# Altium schematic sheet Green Loop.SchDoc
size A3; SheetNumber: 5; SheetTotal: 11
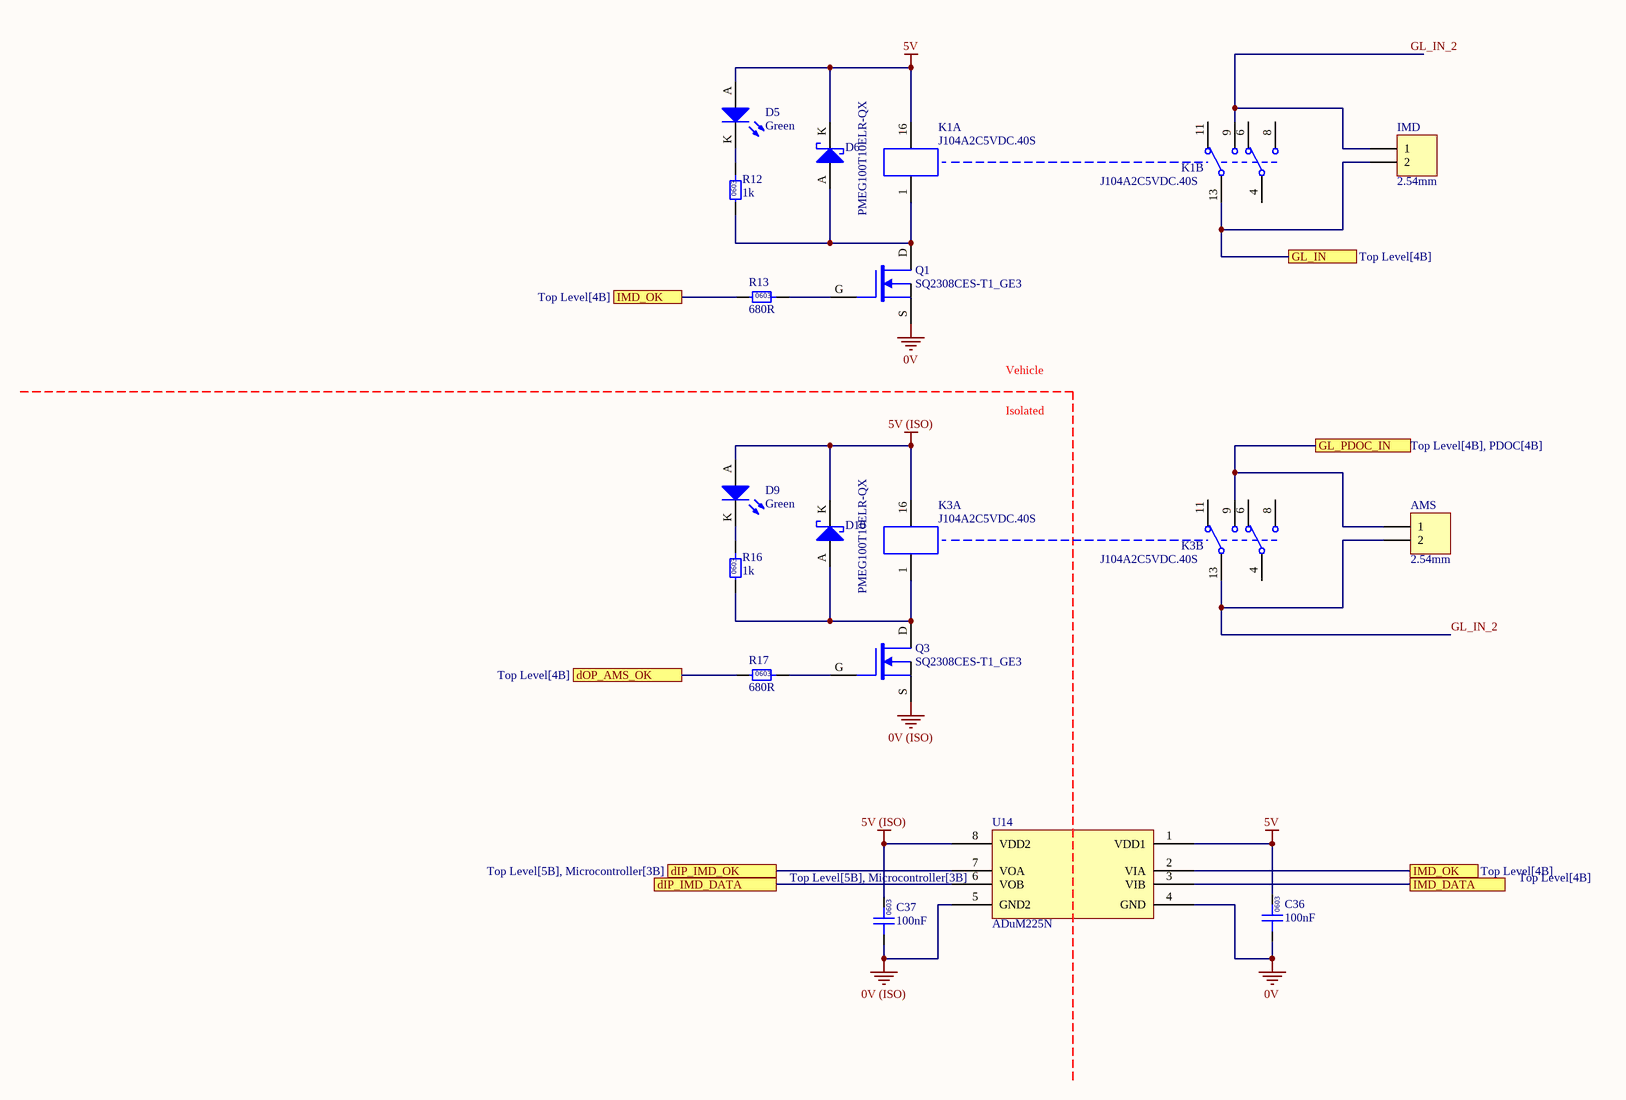
[diagram p0: Green Loop.SchDoc]

## Parts
AMS  2.54mm  [TH 2.54mm Header 1x2]
C36  100nF  [0603]
C37  100nF  [0603]
D5  Green  [0805 LED]
D6  PMEG100T10ELR-QX  [NXP SOD123W]
D9  Green  [0805 LED]
D10  PMEG100T10ELR-QX  [NXP SOD123W]
IMD  2.54mm  [TH 2.54mm Header 1x2]
K1  J104A2C5VDC.40S  [TI 2-DIL]  (parts A,B of 2)
K3  J104A2C5VDC.40S  [TI 2-DIL]  (parts A,B of 2)
Q1  SQ2308CES-T1_GE3  [VSHY SOT-23-3]
Q3  SQ2308CES-T1_GE3  [VSHY SOT-23-3]
R12  1k  [0603]
R13  680R  [0603]
R16  1k  [0603]
R17  680R  [0603]
U14  ADuM225N  [AD-SOIC-8W]

## Ports
dIP_IMD_DATA (see Top Level[5B], Microcontroller[3B]), dIP_IMD_OK (see Top Level[5B], Microcontroller[3B]), dOP_AMS_OK (see Top Level[4B]), GL_IN (see Top Level[4B]), GL_PDOC_IN (see Top Level[4B], PDOC[4B]), IMD_DATA (see Top Level[4B]), IMD_OK (see Top Level[4B])

## Nets
0V: C36.1 Q1.S U14.4(GND)
0V (ISO): C37.1 Q3.S U14.5(GND2)
5V: C36.2 D5.A D6.K K1.16 U14.1(VDD1)
5V (ISO): C37.2 D9.A D10.K K3.16 U14.8(VDD2)
dIP_IMD_DATA: U14.6(VOB) ; port dIP_IMD_DATA
dIP_IMD_OK: U14.7(VOA) ; port dIP_IMD_OK
dOP_AMS_OK: R17.1 ; port dOP_AMS_OK
GL_IN: IMD.2 K1.13 ; port GL_IN
GL_IN_2: AMS.2 IMD.1 K1.9 K3.13
GL_PDOC_IN: AMS.1 K3.9 ; port GL_PDOC_IN
IMD_DATA: U14.3(VIB) ; port IMD_DATA
IMD_OK: R13.1 U14.2(VIA) ; port IMD_OK
NetD5_K: D5.K R12.2
NetD6_A: D6.A K1.1 Q1.D R12.1
NetD9_K: D9.K R16.2
NetD10_A: D10.A K3.1 Q3.D R16.1
NetQ1_G: Q1.G R13.2
NetQ3_G: Q3.G R17.2

Not connected (* = marked no-connect by the designer): K1 4 6 8 11; K3 4 6 8 11

## Notes on the sheet
- Vehicle
- Isolated
- Section Leader Check:
- Date:
- Title:
- Revision
- Variant
- Project:
- Engineers:
- Sheet
- of
- (in symbol GCM188L81H104KA57D) 0603
- (in symbol RC0603FR-071KL) 0603
- (in symbol RC0603JR-13680RL) 0603

## Library data of the parts
AMS IMD = TH 2.54mm Header 1x2: Positions: 2; Angle: 0; Flange: No; Contact: NA; Part Number: TH 2.54mm Header 1x2; Pitch: 2.54mm; Row Spacing: 2.54mm
C36 C37 = GCM188L81H104KA57D: Manufacturer: muRata; Rated Voltage: 50V; Tolerance: ±10%; Material: MLCC; Temperature Rating: X8L; Part Number: GCM188L81H104KA57D; Value: 100nF; Digikey Part Number: 490-6049-1-ND
D5 D9 = SML-210FTT86: Green LED Indication - Discrete 1.75V 0805 (2012 Metric); Manufacturer: ROHM Semiconductor; Part Number: SML-210FTT86; Colour: Green; Digikey Part Number: 511-1285-1-ND; Digikey Link: https://www.digikey.com/product-detail/en/rohm-semiconductor/SML-210FTT86/511-1285-1-ND/637098
D6 D10 = PMEG100T10ELR-QX: Manufacturer: Nexperia USA Inc.; Forward Voltage: 0.75 V @ 1A; Breakdown Voltage: 100 V; Rated Power: 680 mW; Part Number: PMEG100T10ELR-QX; Digikey Part Number: 1727-PMEG100T10ELR-QXCT-ND
K1 K3 = J104A2C5VDC.40S: RELAY GEN PURPOSE DPDT 3A 5V; Manufacturer: CIT Relay and Switch; Part Number: J104A2C5VDC.40S; Digikey Part Number: 2449-J104A2C5VDC.40S-ND; Digikey Link: https://www.digikey.com.au/en/products/detail/cit-relay-and-switch/J104A2C5VDC-40S/14002119
Q1 Q3 = SQ2308CES-T1_GE3: MOSFET N-CH 60V 2.3A SOT23; Manufacturer: Vishay Siliconix; Type: N-channel; Rated Power: 2W; Published: 24-Mar-1999; LatestRevisionDate: 29-May-2009; LatestRevisionNote: IPC-7351 Footprint Added.; PackageVersion: Sep-2000; PackageReference: SOT-343; Publisher: Altium Limited; PackageDescription: 4-Pin SOT-343 Package 1.3 mm Pitch, 2.1 mm Lead Span; Part Number: SQ2308CES-T1_GE3; Digikey Part Number: SQ2308CES-T1_GE3CT-ND
R12 R16 = RC0603FR-071KL: Manufacturer: YAGEO; Tolerance: 0.01; Rated Power: 0.1W; Part Number: RC0603FR-071KL; Value: 1k; Material: FR-07; Digikey Part Number: 311-1.00KHRCT-ND
R13 R17 = RC0603JR-13680RL: Manufacturer: YAGEO; Tolerance: 0.01; Rated Power: 0.1W; Part Number: RC0603JR-13680RL; Value: 680R; Material: FR-07; Digikey Part Number: 13-RC0603JR-13680RLCT-ND
U14 = ADuM225N: DIGITAL ISOLATOR, DUAL CHANNEL; Manufacturer: Analogue Devices; Part Number: ADuM225N